# Altium schematic sheet v2.0.SchDoc
size 132 x 38 mm
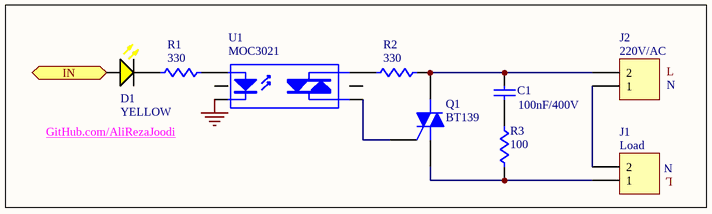
[diagram p0: v2.0.SchDoc]

## Parts
C1  100nF/400V  [CAPR7.62-6.8x5]
D1  YELLOW  [LED_THD_5MM_YELLOW]
J1  2PIN  [Fonics_2PIN_1]  (value not drawn)
J2  2PIN  [Fonics_2PIN_1]  (value not drawn)
Q1  BT139  [TO220V]
R1  330  [AXIAL-0.4]
R2  330  [AXIAL-0.4]
R3  100  [AXIAL-0.4]
U1  MOC3021  [DIP-6]

## Ports
IN (in)

## Nets
GND: U1.2(K)
IN: D1.1(A) ; port IN
NetC1_1: C1.1 R3.2
NetC1_2: C1.2 J2.2 Q1.2(M2) R2.2
NetD1_2: D1.2(K) R1.1
NetJ1_1: J1.1 Q1.1(M1) R3.1
NetJ1_2: J1.2 J2.1
NetQ1_3: Q1.3(G) U1.6(A/K)
NetR1_2: R1.2 U1.1(A)
NetR2_1: R2.1 U1.4(A/K)

Not connected (* = marked no-connect by the designer): U1 3(NC) 5(NC)

## Notes on the sheet
- (near J2) 220V/AC
- (near J2) L
- (near J2) N
- GitHub.com/AliRezaJoodi
- (near J1) Load
- (near J1) N
- (near J1) L

## Library data of the parts
C1 = Cap: Capacitor; Manufacturer: Generic Components; Class I: Passive; Published: 8-Jun-2000; Revision: July-2002: Re-released for DXP Platform.; Publisher: Altium Limited; Class II: Capacitor
D1 = LED_YELLOW: LED, Yellow; Manufacturer: Generic Components; Class I: Optoelectronic; Published: 8-Jun-2000; Revision: July-2002: Re-released for DXP Platform.; Publisher: Altium Limited; Class II: LED
J1 J2 = Header 2: Header, 2-Pin; LatestRevisionDate: 17-Jul-2002; LatestRevisionNote: Re-released for DXP Platform.; Publisher: Altium Limited
Q1 = Triac: Silicon Bidirectional Triode Thyristor; Manufacturer: Generic Components; Class I: Discrete; Note: Pin 2 is electrically connected to Pin 4 (TAB); Published: 29-Sep-2000; Revision: July-2002: Re-released for DXP Platform.; Datasheet: Latest Revision: 1999; Package Reference: 221A-09; Publisher: Altium Limited; Class II: TRIAC
R1-R3 = Res1: Resistor; Manufacturer: Generic Components; Class I: Passive; Published: 8-Jun-2000; Revision: July-2002: Re-released for DXP Platform.; Publisher: Altium Limited; Class II: Resistor
U1 = MOC3021-3: Opto-Triac; Designer: Seyed Mohsen Ghasemian; E-mail: picpars@gmail.com; Published: 17-11-2011; LatestRevisionDate: 17-11-2011; Publisher: www.picpars.com; WEB: www.picpars.com